# EAGLE design v1 4 button (EAGLE 9.6.2)
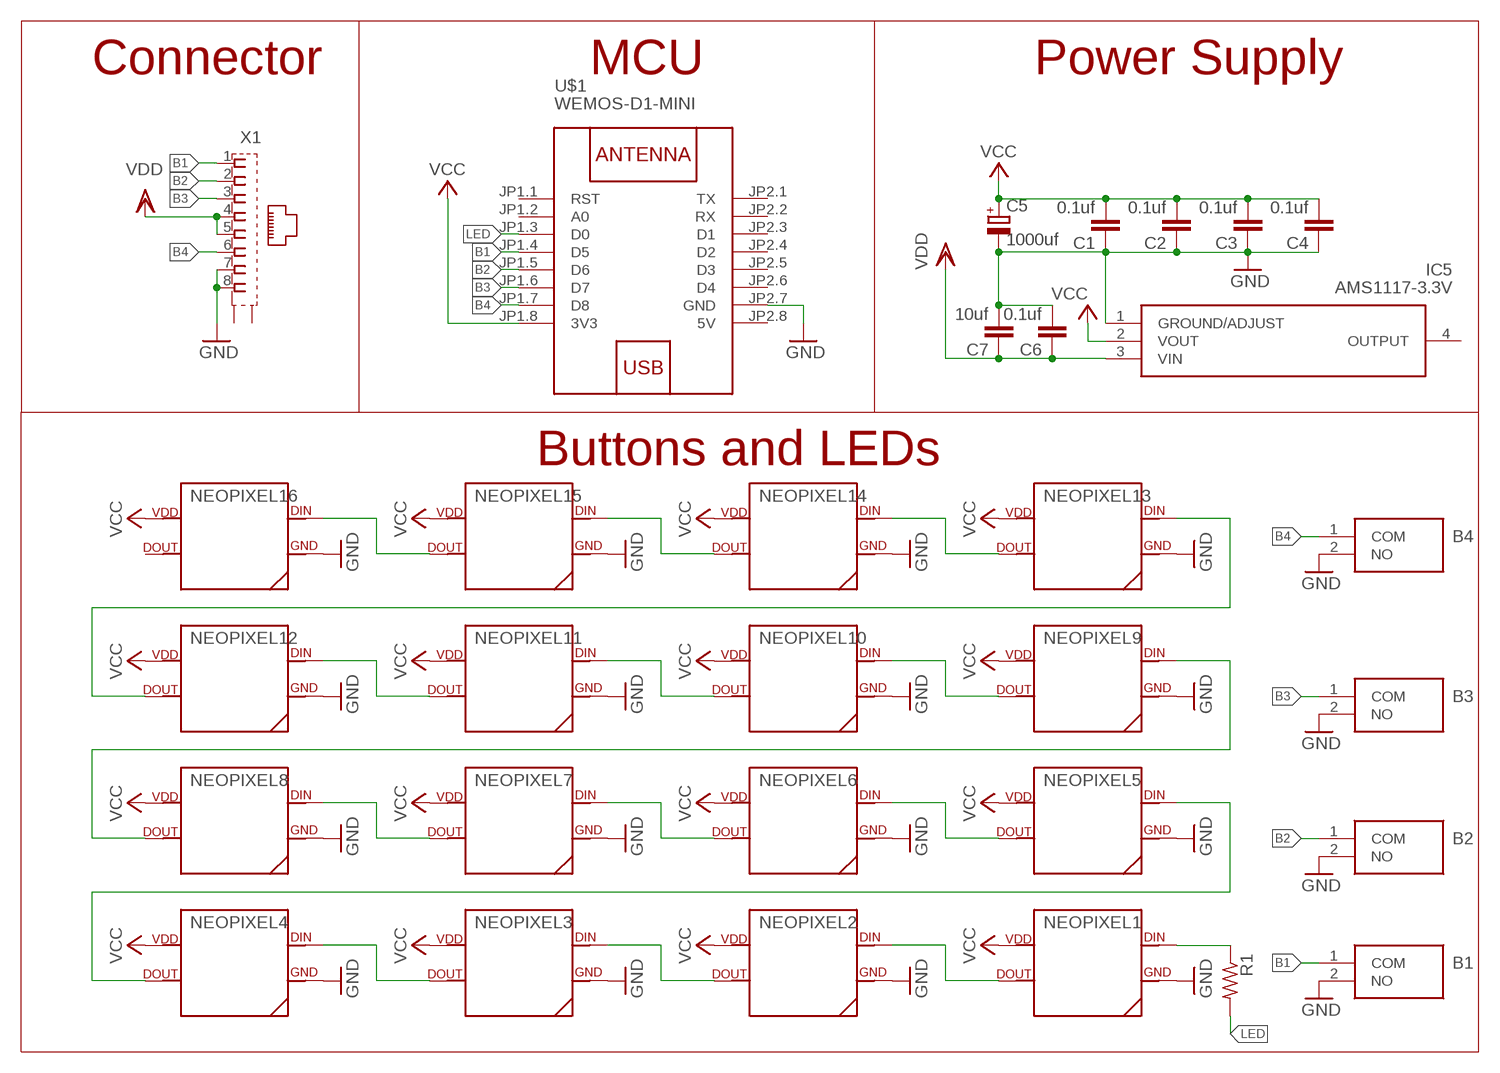
[diagram p0: schematic, sheet 1]

## Parts
B1  PTS636_SM25F_SMTR_LFS  [PTS636SM25FSMTRLFS]
B2  PTS636_SM25F_SMTR_LFS  [PTS636SM25FSMTRLFS]
B3  PTS636_SM25F_SMTR_LFS  [PTS636SM25FSMTRLFS]
B4  PTS636_SM25F_SMTR_LFS  [PTS636SM25FSMTRLFS]
C1  0.1uf  C-EUC0603  [C0603]
C2  0.1uf  C-EUC0603  [C0603]
C3  0.1uf  C-EUC0603  [C0603]
C4  0.1uf  C-EUC0603  [C0603]
C5  1000uf  CPOL-EUUD-6,3X7,7  [UD-6,3X7,7_NICHICON]
C6  0.1uf  C-EUC0603  [C0603]
C7  10uf  C-EUC0603  [C0603]
IC5  AMS1117-3.3V  [SOT229P700X180-4N]
NEOPIXEL1  SK6812NEOPIXEL5050  [SK6812]
NEOPIXEL2  SK6812NEOPIXEL5050  [SK6812]
NEOPIXEL3  SK6812NEOPIXEL5050  [SK6812]
NEOPIXEL4  SK6812NEOPIXEL5050  [SK6812]
NEOPIXEL5  SK6812NEOPIXEL5050  [SK6812]
NEOPIXEL6  SK6812NEOPIXEL5050  [SK6812]
NEOPIXEL7  SK6812NEOPIXEL5050  [SK6812]
NEOPIXEL8  SK6812NEOPIXEL5050  [SK6812]
NEOPIXEL9  SK6812NEOPIXEL5050  [SK6812]
NEOPIXEL10  SK6812NEOPIXEL5050  [SK6812]
NEOPIXEL11  SK6812NEOPIXEL5050  [SK6812]
NEOPIXEL12  SK6812NEOPIXEL5050  [SK6812]
NEOPIXEL13  SK6812NEOPIXEL5050  [SK6812]
NEOPIXEL14  SK6812NEOPIXEL5050  [SK6812]
NEOPIXEL15  SK6812NEOPIXEL5050  [SK6812]
NEOPIXEL16  SK6812NEOPIXEL5050  [SK6812]
R1  R-US_R0603  [R0603]
U$1  WEMOS-D1-MINI  [WEMOS-D1-MINI]
X1  0446200002  [0446200002]

## Nets
B1: B1.1(COM) U$1.JP1.4(D5) X1.1
B2: B2.1(COM) U$1.JP1.5(D6) X1.2
B3: B3.1(COM) U$1.JP1.6(D7) X1.3
B4: B4.1(COM) U$1.JP1.7(D8) X1.6
GND: B1.2(NO) B2.2(NO) B3.2(NO) B4.2(NO) C1.1 C2.1 C3.1 C4.1 C5.- C6.2 C7.2 IC5.1(GROUND/ADJUST) NEOPIXEL1.3(GND) NEOPIXEL2.3(GND) NEOPIXEL3.3(GND) NEOPIXEL4.3(GND) NEOPIXEL5.3(GND) NEOPIXEL6.3(GND) NEOPIXEL7.3(GND) NEOPIXEL8.3(GND) NEOPIXEL9.3(GND) NEOPIXEL10.3(GND) NEOPIXEL11.3(GND) NEOPIXEL12.3(GND) NEOPIXEL13.3(GND) NEOPIXEL14.3(GND) NEOPIXEL15.3(GND) NEOPIXEL16.3(GND) U$1.JP2.7(GND) X1.7 X1.8
LED: R1.2 U$1.JP1.3(D0)
N$1: NEOPIXEL1.4(DIN) R1.1
N$2: NEOPIXEL1.2(DOUT) NEOPIXEL2.4(DIN)
N$3: NEOPIXEL2.2(DOUT) NEOPIXEL3.4(DIN)
N$4: NEOPIXEL3.2(DOUT) NEOPIXEL4.4(DIN)
N$5: NEOPIXEL4.2(DOUT) NEOPIXEL5.4(DIN)
N$6: NEOPIXEL8.2(DOUT) NEOPIXEL9.4(DIN)
N$7: NEOPIXEL12.2(DOUT) NEOPIXEL13.4(DIN)
N$8: NEOPIXEL5.2(DOUT) NEOPIXEL6.4(DIN)
N$9: NEOPIXEL9.2(DOUT) NEOPIXEL10.4(DIN)
N$10: NEOPIXEL13.2(DOUT) NEOPIXEL14.4(DIN)
N$11: NEOPIXEL6.2(DOUT) NEOPIXEL7.4(DIN)
N$12: NEOPIXEL10.2(DOUT) NEOPIXEL11.4(DIN)
N$13: NEOPIXEL14.2(DOUT) NEOPIXEL15.4(DIN)
N$14: NEOPIXEL7.2(DOUT) NEOPIXEL8.4(DIN)
N$15: NEOPIXEL11.2(DOUT) NEOPIXEL12.4(DIN)
N$16: NEOPIXEL15.2(DOUT) NEOPIXEL16.4(DIN)
VCC: C1.2 C2.2 C3.2 C4.2 C5.+ IC5.2(VOUT) NEOPIXEL1.1(VDD) NEOPIXEL2.1(VDD) NEOPIXEL3.1(VDD) NEOPIXEL4.1(VDD) NEOPIXEL5.1(VDD) NEOPIXEL6.1(VDD) NEOPIXEL7.1(VDD) NEOPIXEL8.1(VDD) NEOPIXEL9.1(VDD) NEOPIXEL10.1(VDD) NEOPIXEL11.1(VDD) NEOPIXEL12.1(VDD) NEOPIXEL13.1(VDD) NEOPIXEL14.1(VDD) NEOPIXEL15.1(VDD) NEOPIXEL16.1(VDD) U$1.JP1.8(3V3)
VDD: C6.1 C7.1 IC5.3(VIN) X1.4 X1.5
Unconnected: IC5.4(OUTPUT) NEOPIXEL16.2(DOUT) U$1.JP1.1(RST) U$1.JP1.2(A0) U$1.JP2.1(TX) U$1.JP2.2(RX) U$1.JP2.3(D1) U$1.JP2.4(D2) U$1.JP2.5(D3) U$1.JP2.6(D4) X1.S@1(S1) X1.S@2(S2)

## Notes on the sheet
- Connector | MCU | Power Supply
- Buttons and LEDs

## Power pins joined to a net without a drawn wire
5V: U$1.JP2.8(5V)

## Library data of the parts
B1-B4 = SamacSys_Parts:PTS636_SM25F_SMTR_LFS: Tactile Switches Tact 50mA 12VDC, 6.0x3.5, 2.5mm H, 180gf, F leads, No ground pin, White Actuator Source: Datasheet <https://ms.componentsearchengine.com/Datasheets/1/PTS636 SM25F SMTR LFS.pdf>; ARROW_PART_NUMBER: PTS636 SM25F SMTR LFS; ARROW_PRICE-STOCK: https://www.arrow.com/en/products/pts636-sm25f-smtr-lfs/ck; DESCRIPTION: Tactile Switches Tact 50mA 12VDC, 6.0x3.5, 2.5mm H, 180gf, F leads, No ground pin, White Actuator; HEIGHT: 2.7mm; MANUFACTURER_NAME: C & K COMPONENTS; MANUFACTURER_PART_NUMBER: PTS636 SM25F SMTR LFS; MOUSER_PART_NUMBER: 611-PTS636SM25FSMTRL; MOUSER_PRICE-STOCK: https://www.mouser.co.uk/ProductDetail/CK/PTS636-SM25F-SMTR-LFS?qs=vLWxofP3U2wcBTQSwfMFOw%3D%3D
C1-C4 C6 C7 = rcl:C-EU: CAPACITOR, European symbol; SPICEPREFIX: C
C5 = rcl:CPOL-EU: POLARIZED CAPACITOR, European symbol; SPICEPREFIX: C
IC5 = SamacSys_Parts:AMS1117-3.3V: 1A LOW DROPOUT VOLTAGE REGULATOR, SOT-223 Source: Datasheet <http://www.advanced-monolithic.com/pdf/ds1117.pdf>; DESCRIPTION: 1A LOW DROPOUT VOLTAGE REGULATOR, SOT-223; HEIGHT: 1.8mm; MANUFACTURER_NAME: Advanced Monolithic Systems; MANUFACTURER_PART_NUMBER: ams1117-3.3v
NEOPIXEL1-NEOPIXEL16 = custom parts:SK6812: for 5050 sk6812 LED
R1 = resistor:R-US_: RESISTOR, American symbol
U$1 = diy-modules:WEMOS-D1-MINI: WEMOS D1 mini: Mini Wi-Fi Board based on ESP-8266 device More details can be found here: https://www.wemos.cc/product/d1-mini.html Click here to find device on ebay.com <http://www.ebay.com/sch/wemos+d1+mini+nodemcu>
X1 = con-molex:0446200002: RJ-45 INVERTED MODULAR JACK ASSEMBLY WITH RJ-11 KEEPOUT FEATURE Source: Data sheet <http://www.farnell.com/datasheets/73207.pdf> MOLEX 0446200002 BUCHSE, RJ45, GESCHIRMT Source: Farnell <http://de.farnell.com/molex/0446200002/buchse-rj45-geschirmt/dp/9251910?ost=9251910>; MF: MOLEX; MPN: 0446200002; OC_FARNELL: 9251910

## Board
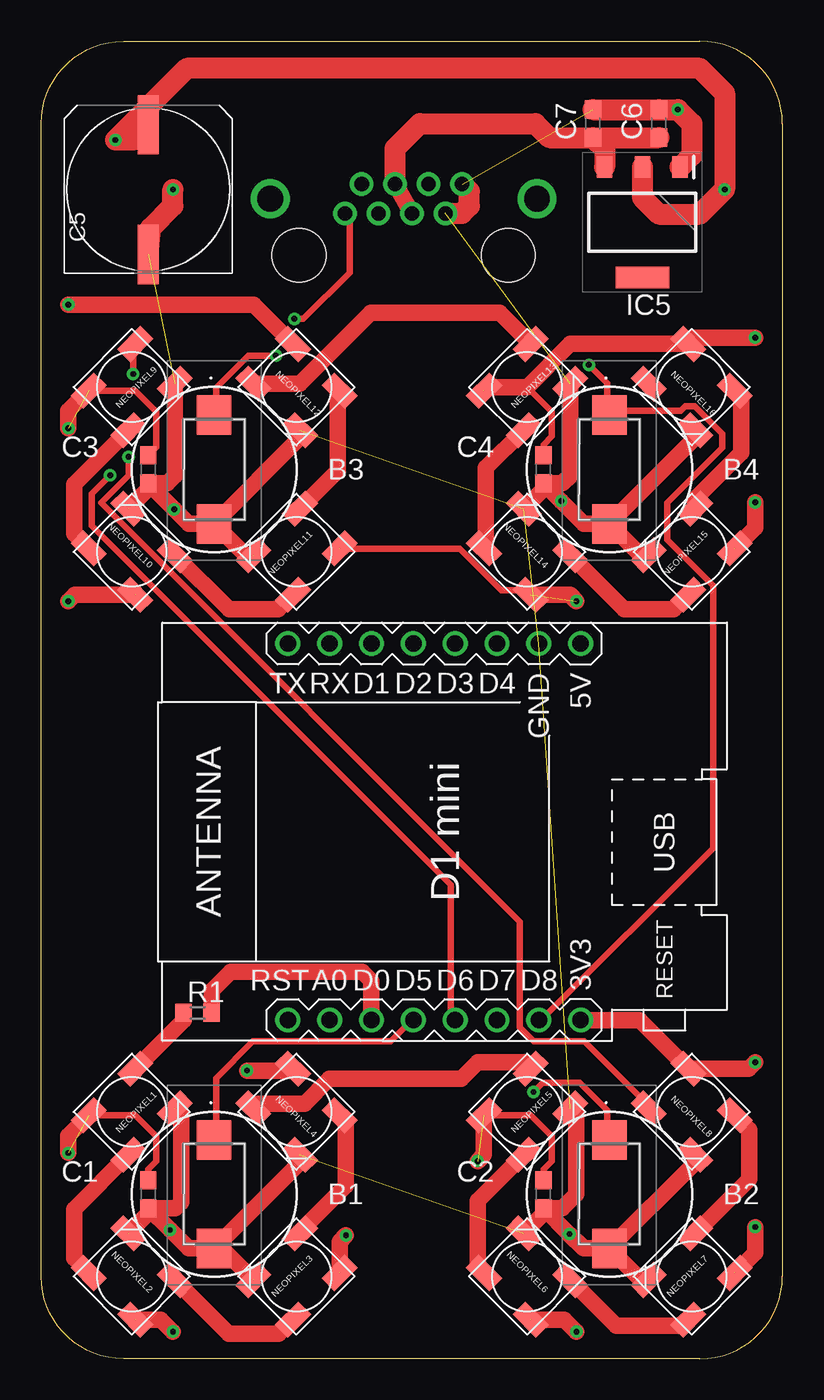
[diagram p1: board, top side]
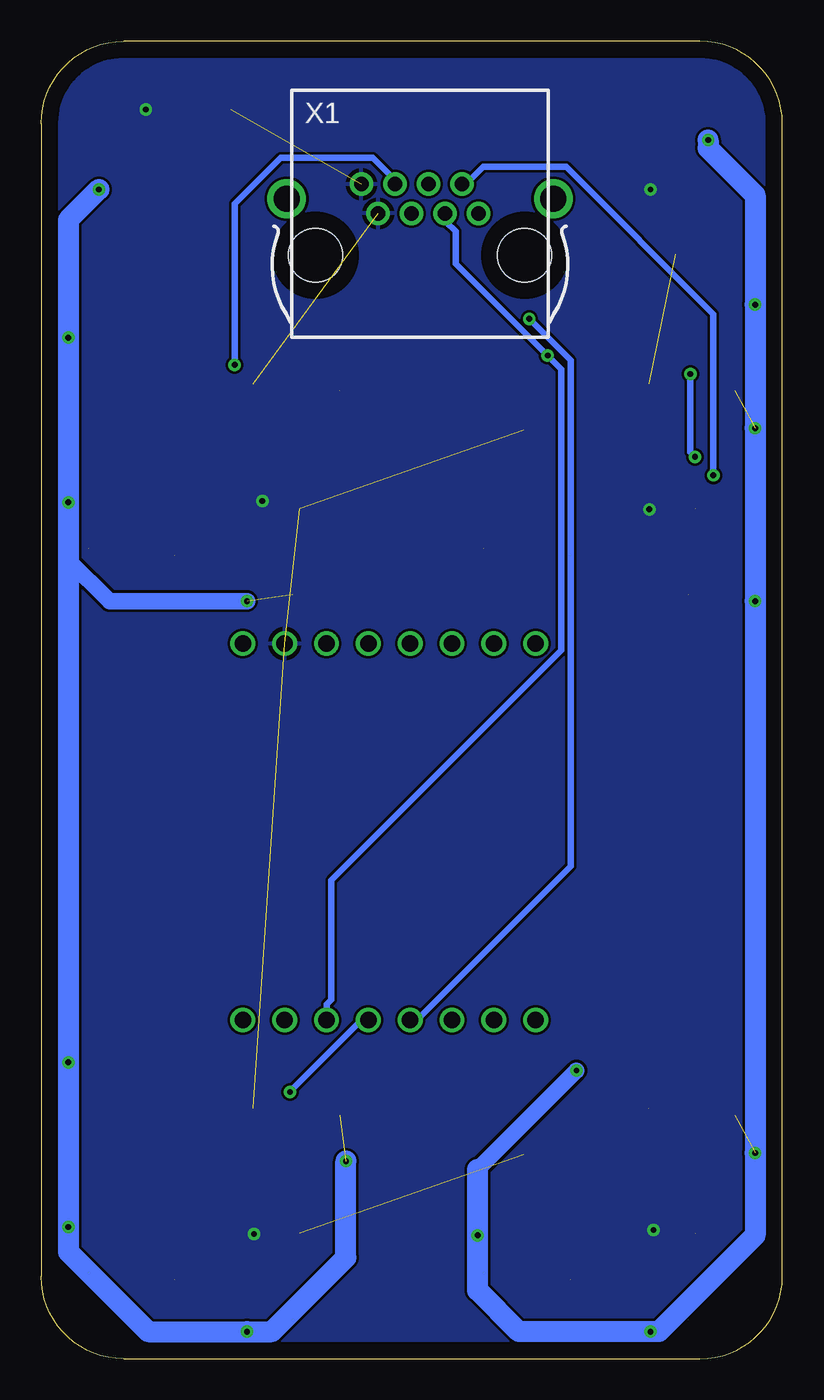
[diagram p2: board, bottom side, seen from below]

Size 45 x 80 mm. Coordinates in mm from the lower left corner, seen from the top.
Outline: 0,5 0,75 arc-90 5,80 40,80 arc-90 45,75 45,5 arc-90 40,0 5,0 arc-90 0,5
Copper layers (1*16): Top 0.035mm / dielectric 1.5mm / Bottom 0.035mm
Design rules "default *": minimum track width 16mil, minimum drill 0.35mm, track to track 6mil, track to pad 6mil, pad to pad 6mil, via to via 6mil, smd to smd 6mil, copper to edge 40mil, drill to drill 6mil, minimum pad ring 10mil, minimum via ring 8mil, stop-mask expansion 4mil, vias tented up to drill 0mil, thermal gap 10mil

### Footprints (pad centres in the part's own frame; a part is rotated, then mirrored left to right if it is on the bottom)
PTS636SM25FSMTRLFS = smd 2.4 x 2.1: 1 -3.3,0; 2 3.3,0
C0603 = smd 1.1 x 1: 1 -0.85,0; 2 0.85,0
UD-10X10_NICHICON = smd 3.6 x 1.3: + 3.925,0; - -3.95,0
SOT229P700X180-4N = smd 1.3 x 0.95: 1 -3.35,2.29; 2 -3.35,0; 3 -3.35,-2.29 | smd 1.3 x 3.25: 4 3.35,0
SK6812 = smd 2 x 1.1: 1 -2,1.7; 2 -2,-1.7; 3 2,-1.7; 4 2,1.7
R0603 = smd 1 x 1.1: 1 -0.85,0; 2 0.85,0
WEMOS-D1-MINI = drill 1: JP1.1 -11.43,9.525; JP1.2 -11.43,6.985; JP1.3 -11.43,4.445; JP1.4 -11.43,1.905; JP1.5 -11.43,-0.635; JP1.6 -11.43,-3.175; JP1.7 -11.43,-5.715; JP1.8 -11.43,-8.255; JP2.1 11.43,9.525; JP2.2 11.43,6.985; JP2.3 11.43,4.445; JP2.4 11.43,1.905; JP2.5 11.43,-0.635; JP2.6 11.43,-3.175; JP2.7 11.43,-5.715; JP2.8 11.43,-8.255
0446200002 = drill 0.889 pad 1.422: 1 3.556,2.54; 2 2.54,4.318; 3 1.524,2.54; 4 0.508,4.318; 5 -0.508,2.54; 6 -1.524,4.318; 7 -2.54,2.54; 8 -3.556,4.318 | drill 1.575 pad 2.286: S@1 -8.103,3.429; S@2 8.103,3.429 | hole 3.251: 6.35,0; -6.35,0

### Placement (x,y rotation side)
B1  10.5,10 270 top
B2  34.5,10 270 top
B3  10.5,54 270 top
B4  34.5,54 270 top
C1  6.5,10 90 top
C2  30.5,10 90 top
C3  6.5,54 90 top
C4  30.5,54 90 top
C5  1000uf  [UD-10X10_NICHICON]  6.5,71 90 top
C6  37.5,75 90 top
C7  33.5,75 90 top
IC5  36.5,69 270 top
NEOPIXEL1  5.5,15 45 top
NEOPIXEL2  5.5,5 135 top
NEOPIXEL3  15.5,5 225 top
NEOPIXEL4  15.5,15 315 top
NEOPIXEL5  29.5,15 45 top
NEOPIXEL6  29.5,5 135 top
NEOPIXEL7  39.5,5 225 top
NEOPIXEL8  39.5,15 315 top
NEOPIXEL9  5.5,59 45 top
NEOPIXEL10  5.5,49 135 top
NEOPIXEL11  15.5,49 225 top
NEOPIXEL12  15.5,59 315 top
NEOPIXEL13  29.5,59 45 top
NEOPIXEL14  29.5,49 135 top
NEOPIXEL15  39.5,49 225 top
NEOPIXEL16  39.5,59 315 top
R1  9.5,21 0 top
U$1  24.5,32 90 top
X1  22,67 0 bottom

### Tracks (layer width: path | path; a pad name or v marks a point on that pad's centre or on a via)
B1  (via drill 0.35)
  Top 0.406: B1.1 10.62,13.41 10.62,17.04 12.85,19.28 21.23,19.28 22.35,20.4 U$1.JP1.4 | v15.37,63.14 15.93,63.14 18.72,65.94 18.72,69.29 X1.1
  Bottom 0.406: v15.37,63.14 12.85,60.63 12.85,29.9 22.35,20.4 U$1.JP1.4
B2  (via drill 0.35)
  Top 0.406: v29.9,16.2 30.45,16.76 32.69,16.76 34.37,15.09 34.37,13.41 B2.1 | v4.19,53.65 3.07,52.53 3.07,50.57 24.87,28.78 24.87,20.68 U$1.JP1.5
  Bottom 0.406: v29.9,16.2 25.7,20.4 25.15,20.4 U$1.JP1.5 | v4.19,53.65 4.19,63.42 13.13,72.36 18.16,72.36 19,71.53 19.28,71.53 X1.2
B3  (via drill 0.35)
  Top 0.406: v14.25,60.91 12.57,60.91 10.62,58.95 10.62,57.56 B3.1
  Bottom 0.406: X1.3 20.4,69.57 20.12,69.29 20.4,69.01 19.84,68.45 19.84,66.5 v14.25,60.91 13.41,60.07 13.41,43.03 27.38,29.06 27.38,21.79 27.66,21.51 27.66,20.68 U$1.JP1.6
B4  (via drill 0.35)
  Top 0.406: U$1.JP1.7 30.45,20.68 40.79,31.01 40.79,46.94 38,49.73 38,51.97 41.35,55.32 41.35,56.16 39.67,57.84 39.12,57.84 38.84,57.56 34.65,57.56 B4.1 34.37,57.56 34.37,59.23 v33.25,60.35
  Bottom 0.406: v33.25,60.35 33.25,70.13 30.45,72.92 24.87,72.92 23.75,71.81 23.75,71.53 X1.6
GND  (via drill 0.35)  (19 unrouted)
  Top 1.016: NEOPIXEL10.3 6.5,52.83 C3.1 | C3.1 v8.07,51.58 8.95,50.7 B3.2 | B3.2 12.41,48.79 NEOPIXEL11.3 | NEOPIXEL6.3 30.5,8.83 C2.1 | C2.1 v32.08,7.58 32.95,6.7 B2.2 | B2.2 36.41,4.79 NEOPIXEL7.3 | C2.1 31.65,9.15 32.5,10 32.5,14.83 NEOPIXEL5.3 | B2.2 39.71,11.91 NEOPIXEL8.3 | B1.2 10.97,6.7 NEOPIXEL3.3 | B1.2 15.71,11.91 NEOPIXEL4.3 | B1.2 8.95,6.7 v7.83,7.83 C1.1 | NEOPIXEL2.3 6.5,8.83 C1.1 | C1.1 8.15,9.15 8.5,9.5 8.5,14.83 NEOPIXEL1.3 | C3.1 7.65,53.15 8.12,53.62 NEOPIXEL9.3 | B3.2 15.71,55.91 NEOPIXEL12.3 | NEOPIXEL14.3 30.5,52.83 C4.1 | C4.1 v31.57,52.08 32.95,50.7 B4.2 | B4.2 36.41,48.79 NEOPIXEL15.3 | B4.2 39.71,55.91 NEOPIXEL16.3 | C4.1 31.65,53.15 32.12,53.62 NEOPIXEL13.3
  Top 1.27: C7.2 C6.2 v38.65,75.85 39.5,75 39.5,73.06 IC5.1 | C5.- 6.65,68.65 8,70 v8,71 | X1.7 25.54,69.54 26,70 26,70.87 X1.8
  pour Bottom: 5,80 arc90 0,75 0,5 arc90 5,0 6,0 40,0 arc90 45,5 45,75 arc90 40,80 39,80
LED
  Top 1.016: U$1.JP1.3 20.05,22.95 19.5,23.5 11.5,23.5 10.35,22.35 R1.2
N$1
  Top 1.016: NEOPIXEL1.4 8.65,20.55 R1.1
N$2
  Top 1.016: NEOPIXEL1.2 2,9.1 2,6.1 NEOPIXEL2.4
N$3
  Top 1.016: NEOPIXEL2.2 11.38,1.52 14.43,1.52 NEOPIXEL3.4
N$4
  Top 1.016: NEOPIXEL3.2 15.71,7.71 18.5,10.5 18.5,14.4 NEOPIXEL4.4
N$5
  Top 1.016: NEOPIXEL4.2 13.17,15.5 16,15.5 17.5,17 25.5,17 26.5,18 29.33,18 NEOPIXEL5.4
N$6  (via drill 0.35)
  Top 0.406: v5.59,59.79 5.59,61.47 NEOPIXEL9.4 | v5.31,54.76 5.31,53.65 3.63,51.97 29.06,26.54 29.06,20.12 29.9,19.28 32.97,19.28 36.88,15.37 NEOPIXEL8.2
  Bottom 0.406: v5.59,59.79 5.59,55.04 v5.31,54.76
N$7
  Top 1.016: NEOPIXEL12.2 15.71,59.21 20,63.5 27.83,63.5 NEOPIXEL13.4
N$8
  Top 1.016: NEOPIXEL5.2 26.5,9.6 26.5,5.6 NEOPIXEL6.4
N$9
  Top 1.016: NEOPIXEL9.2 2,53.1 2,50.1 NEOPIXEL10.4
N$10
  Top 1.016: NEOPIXEL13.2 27,54.1 27,49.33 NEOPIXEL14.4
N$11
  Top 1.016: NEOPIXEL6.2 34.9,2 38.9,2 NEOPIXEL7.4
N$12
  Top 1.016: NEOPIXEL10.2 11.4,45.5 14.4,45.5 NEOPIXEL11.4
N$13
  Top 1.016: NEOPIXEL14.2 35.4,45.5 38.4,45.5 NEOPIXEL15.4
N$14
  Top 1.016: NEOPIXEL7.2 43,10.9 43,13.9 NEOPIXEL8.4
N$15
  Top 1.016: NEOPIXEL11.2 18,53.9 18,58.67 NEOPIXEL12.4
N$16
  Top 1.016: NEOPIXEL15.2 39.71,52.21 42.5,55 42.5,58.4 NEOPIXEL16.4
VCC  (via drill 0.35)  (12 unrouted)
  Top 0.406: C4.2 30.5,55.5 31,56 31,57.5 29.5,59 | NEOPIXEL9.1 5.71,58.79 7,57.5 7,55.35 C3.2 | C2.2 30.5,11.5 31,12 31,13.5 29.71,14.79 NEOPIXEL5.1 | C1.2 6.5,11.5 7,12 7,13.5 5.71,14.79 NEOPIXEL1.1 | NEOPIXEL11.1 18.16,49.17 25.43,49.17 27.94,46.66 29.34,46.66 NEOPIXEL14.1
  Top 1.016: NEOPIXEL7.1 43.35,6.45 v43.35,8 | NEOPIXEL6.1 31.77,2.38 v32.5,1.65 | NEOPIXEL5.1 26.88,12.38 v26.5,12 | v43.35,18 42.97,17.62 NEOPIXEL8.1 36.33,20.57 U$1.JP1.8 | NEOPIXEL4.1 15.17,17.5 v12.5,17.5 | NEOPIXEL1.1 1.65,13.55 v1.65,12.5 | NEOPIXEL2.1 7.27,2.38 v8,1.65 | NEOPIXEL3.1 18.12,7.12 v18.5,7.5 | NEOPIXEL10.1 2.04,46.38 v1.65,46 | NEOPIXEL9.1 1.65,57.55 v1.65,56.5 | NEOPIXEL15.1 43.35,50.45 v43.35,52 | v43.35,62 39.67,62 NEOPIXEL16.1 32.12,61.62 29.5,59 27.1,59 NEOPIXEL13.1 | NEOPIXEL14.1 32.12,46.38 v32.5,46 | NEOPIXEL12.1 12.9,64 v1.65,64
  Top 1.27: IC5.2 36.5,70.5 37.5,69.5 40,69.5 v41.5,71 41.5,76.85 40,78.35 8.85,78.35 v4.5,74 5.58,74 C5.+
  Bottom 1.016: 18.5,11.5 v12.5,17.5 | v32.5,46 40.85,46 43.35,48.5
  Bottom 1.27: v4.5,74 4.5,73.5 1.65,70.65 v1.65,64 v1.65,56.5 v1.65,46 v1.65,12.5 1.65,7.5 7.5,1.65 v8,1.65 16,1.65 18.5,4.15 v18.5,7.5 18.5,11.5 | v41.5,71 43.35,69.15 v43.35,62 v43.35,52 43.35,48.5 v43.35,18 v43.35,8 43.35,6.5 38.5,1.65 v32.5,1.65 31,1.65 26.5,6.15 v26.5,12
VDD
  Top 1.016: X1.5 X1.4
  Top 1.27: C7.1 30.85,74.15 30,75 23,75 21.49,73.49 X1.4 | C7.1 34.21,73.44 IC5.3 | C7.1 C6.1